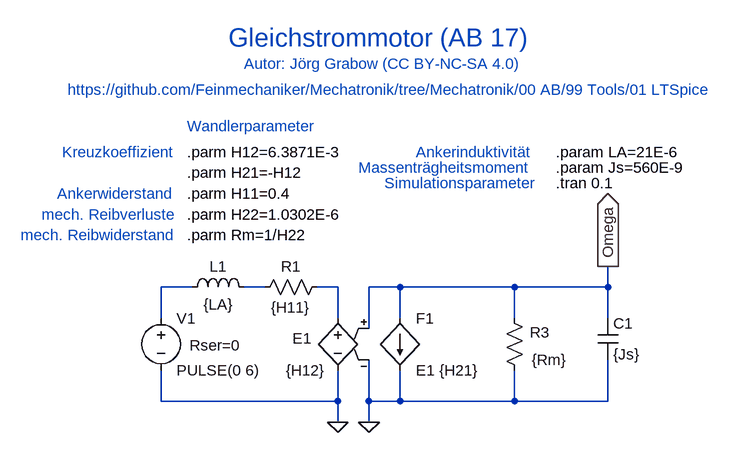
[diagram p0: schematic LAB_17_1.asc]
LAB_17_1.asc, the LTspice schematic file:
Version 4
SHEET 1 880 680
WIRE -2592 -640 -2640 -640
WIRE -2480 -640 -2512 -640
WIRE -2368 -640 -2400 -640
WIRE -2272 -640 -2320 -640
WIRE -2096 -640 -2272 -640
WIRE -1952 -640 -1952 -672
WIRE -1952 -640 -2096 -640
WIRE -2640 -592 -2640 -640
WIRE -2368 -592 -2368 -640
WIRE -2272 -592 -2272 -640
WIRE -2096 -592 -2096 -640
WIRE -1952 -592 -1952 -640
WIRE -2320 -576 -2320 -640
WIRE -2640 -464 -2640 -512
WIRE -2368 -464 -2368 -512
WIRE -2368 -464 -2640 -464
WIRE -2320 -464 -2320 -528
WIRE -2272 -464 -2272 -512
WIRE -2272 -464 -2320 -464
WIRE -2096 -464 -2096 -512
WIRE -2096 -464 -2272 -464
WIRE -1952 -464 -1952 -528
WIRE -1952 -464 -2096 -464
WIRE -2368 -432 -2368 -464
WIRE -2320 -432 -2320 -464
FLAG -2368 -432 0
FLAG -2320 -432 0
FLAG -1952 -672 Omega
IOPIN -1952 -672 Out
SYMBOL res -2496 -624 R270
WINDOW 0 32 56 VTop 2
WINDOW 3 0 56 VBottom 2
SYMATTR InstName R1
SYMATTR Value {H11}
SYMBOL res -2112 -608 R0
WINDOW 0 40 38 Left 2
WINDOW 3 43 80 Left 2
SYMATTR InstName R3
SYMATTR Value {Rm}
SYMBOL voltage -2640 -608 R0
WINDOW 39 44 58 Left 2
SYMATTR SpiceLine Rser=0
SYMATTR Value2 AC 0 0
SYMATTR InstName V1
SYMATTR Value PULSE(0 6)
SYMBOL f -2272 -592 R0
SYMATTR Value E1 {H21}
SYMATTR InstName F1
SYMBOL e -2368 -608 M0
WINDOW 0 40 47 Left 2
WINDOW 3 19 96 Left 2
SYMATTR InstName E1
SYMATTR Value {H12}
SYMBOL ind -2608 -624 R270
WINDOW 0 32 56 VTop 2
WINDOW 3 5 56 VBottom 2
SYMATTR InstName L1
SYMATTR Value {LA}
SYMATTR SpiceLine Rser=0
SYMBOL cap -1968 -592 R0
SYMATTR InstName C1
SYMATTR Value {Js}
TEXT -2600 -816 Left 2 !.parm H21=-H12
TEXT -2600 -848 Left 2 !.parm H12=6.3871E-3
TEXT -2600 -784 Left 2 !.parm H11=0.4
TEXT -2600 -720 Left 2 !.parm Rm=1/H22
TEXT -2600 -752 Left 2 !.parm H22=1.0302E-6
TEXT -2600 -888 Left 2 ;Wandlerparameter
TEXT -2536 -1024 Left 4 ;Gleichstrommotor (AB 17)
TEXT -2784 -944 Left 2 ;https://github.com/Feinmechaniker/Mechatronik/tree/Mechatronik/00 AB/99 Tools/01 LTSpice
TEXT -2512 -984 Left 2 ;Autor: Jörg Grabow (CC BY-NC-SA 4.0)
TEXT -2032 -800 Left 2 !.tran 0.1
TEXT -2296 -800 Left 2 ;Simulationsparameter
TEXT -2248 -848 Left 2 ;Ankerinduktivität
TEXT -2336 -824 Left 2 ;Massenträgheitsmoment
TEXT -2032 -824 Left 2 !.param Js=560E-9
TEXT -2032 -848 Left 2 !.param LA=21E-6
TEXT -2800 -784 Left 2 ;Ankerwiderstand
TEXT -2824 -752 Left 2 ;mech. Reibverluste
TEXT -2792 -848 Left 2 ;Kreuzkoeffizient
TEXT -2856 -720 Left 2 ;mech. Reibwiderstand

The netlist it stands for:
* LAB_17_1.asc
R1 N002 N003 {H11}
R3 Omega 0 {Rm}
V1 N001 0 PULSE(0 6) AC 0 0 Rser=0
F1 Omega 0 E1 {H21}
E1 N003 0 Omega 0 {H12}
L1 N001 N002 {LA} Rser=0
C1 Omega 0 {Js}
.parm H21=-H12
.parm H12=6.3871E-3
.parm H11=0.4
.parm Rm=1/H22
.parm H22=1.0302E-6
* Wandlerparameter
* Gleichstrommotor (AB 17)
* https://github.com/Feinmechaniker/Mechatronik/tree/Mechatronik/00 AB/99 Tools/01 LTSpice
* Autor: Jörg Grabow (CC BY-NC-SA 4.0)
.tran 0.1
* Simulationsparameter
* Ankerinduktivität
* Massenträgheitsmoment
.param Js=560E-9
.param LA=21E-6
* Ankerwiderstand
* mech. Reibverluste
* Kreuzkoeffizient
* mech. Reibwiderstand
.backanno
.end